# Altium schematic sheet MAIN.SchDoc: Shipwars Main Schematic
size 431 x 279 mm; Date: 02/14/2022; CheckedBy: SP, PS; Author: SP, PS; CompanyName: UPenn; DrawnBy: SP, PS; Engineer: SP, PS; Organization: UPenn; Address1: 200 S 33rd Street; Address2: Detkin Lab; Address3: Philadelphia; Address4: PA 19104; Revision: .1.0.0; SheetNumber: 1; SheetTotal: 10; Project: Shipwars; Time: 19:00
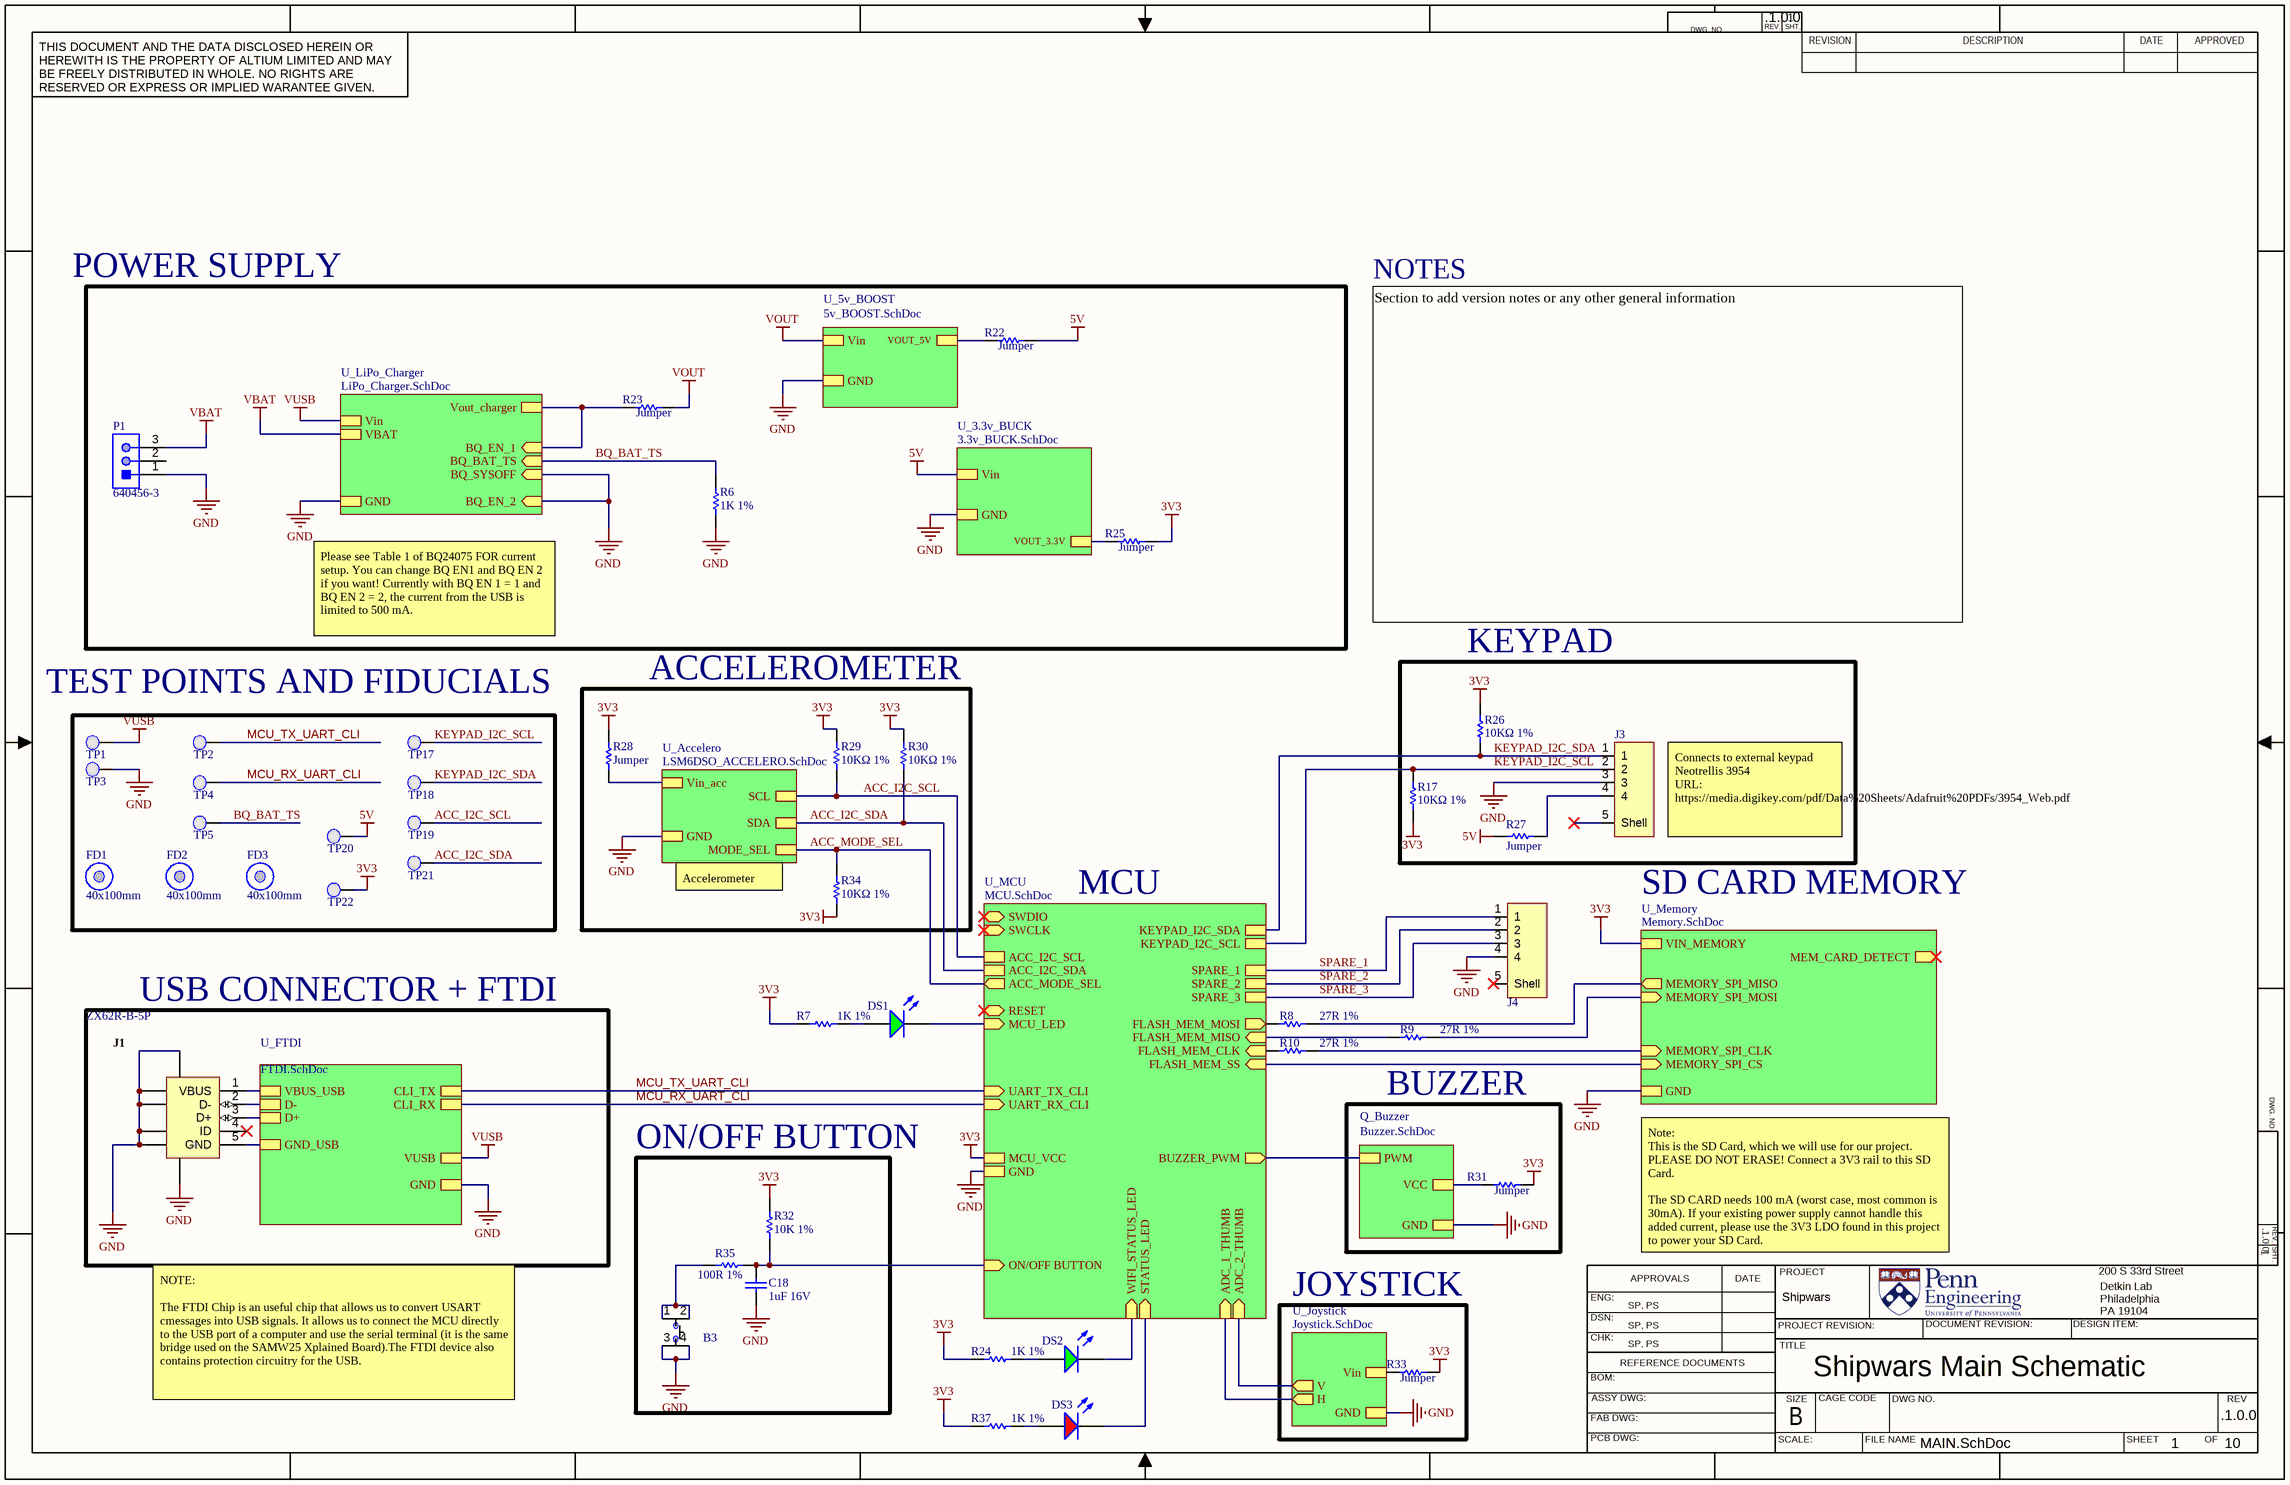
[diagram p0: MAIN.SchDoc]

## Parts
B3  PTS810 SJK 250 SMTR LFS  [PTS810 SJK 250 SMTR LFS]  (value not drawn)
C18  1uF 16V  [CAPC0603(1608)100_N]
DS1  LTST-C170GKT  [LTST-C170GKT_V]  (value not drawn)
DS2  LTST-C170GKT  [LTST-C170GKT_V]  (value not drawn)
DS3  LTST-C170CKT  [LTST-C170CKT_V]  (value not drawn)
FD1  40x100mm  [Fiducial_FT]  (no BOM)
FD2  40x100mm  [Fiducial_FT]  (no BOM)
FD3  40x100mm  [Fiducial_FT]  (no BOM)
J1  ZX62R-B-5P  [HIRO-ZX62R-B-5P_V]
J3  S4B-PH-SM4-TB(LF)(SN)  [S4B-PH-SM4-TB(LF)(SN)]  (value not drawn)
J4  S4B-PH-SM4-TB(LF)(SN)  [S4B-PH-SM4-TB(LF)(SN)]  (value not drawn)
P1  640456-3  [TECO-640456-3]
R6  1K 1%  [RESC0603(1608)_N]
R7  1K 1%  [RESC0603(1608)_N]
R8  27R 1%  [RESC0603(1608)_N]
R9  27R 1%  [RESC0603(1608)_N]
R10  27R 1%  [RESC0603(1608)_N]
R17  10KΩ 1%  [RESC0603(1608)_N]
R22  Jumper  [RESC0603(1608)_N]
R23  Jumper  [RESC0603(1608)_N]
R24  1K 1%  [RESC0603(1608)_N]
R25  Jumper  [RESC0603(1608)_N]
R26  10KΩ 1%  [RESC0603(1608)_N]
R27  Jumper  [RESC0603(1608)_N]
R28  Jumper  [RESC0603(1608)_N]
R29  10KΩ 1%  [RESC0603(1608)_N]
R30  10KΩ 1%  [RESC0603(1608)_N]
R31  Jumper  [RESC0603(1608)_N]
R32  10K 1%  [RESC0603(1608)_N]
R33  Jumper  [RESC0603(1608)_N]
R34  10KΩ 1%  [RESC0603(1608)_N]
R35  100R 1%  [RESC0603(1608)_N]
R37  1K 1%  [RESC0603(1608)_N]
TP1  0.1" Pad  [PCBComponent]  (value not drawn)  (no BOM)
TP2  0.1" Pad  [PCBComponent]  (value not drawn)  (no BOM)
TP3  0.1" Pad  [PCBComponent]  (value not drawn)  (no BOM)
TP4  0.1" Pad  [PCBComponent]  (value not drawn)  (no BOM)
TP5  0.1" Pad  [PCBComponent]  (value not drawn)  (no BOM)
TP17  0.1" Pad  [PCBComponent]  (value not drawn)  (no BOM)
TP18  0.1" Pad  [PCBComponent]  (value not drawn)  (no BOM)
TP19  0.1" Pad  [PCBComponent]  (value not drawn)  (no BOM)
TP20  0.1" Pad  [PCBComponent]  (value not drawn)  (no BOM)
TP21  0.1" Pad  [PCBComponent]  (value not drawn)  (no BOM)
TP22  0.1" Pad  [PCBComponent]  (value not drawn)  (no BOM)

## Blocks framed on the sheet
ACCELEROMETER: R28-R30 R34
KEYPAD: J3 R17 R26 R27
USB CONNECTOR + FTDI: J1
BUZZER: R31
ON/OFF BUTTON: B3 C18 R32 R35
JOYSTICK: R33

## Sub-sheets
Q_Buzzer = Buzzer.SchDoc: PWM, VCC, GND
U_3.3v_BUCK = 3.3v_BUCK.SchDoc: Vin, GND, VOUT_3.3V
U_5v_BOOST = 5v_BOOST.SchDoc: Vin, GND, VOUT_5V
U_Accelero = LSM6DSO_ACCELERO.SchDoc: Vin_acc, GND, SCL, SDA, MODE_SEL
U_FTDI = FTDI.SchDoc: VUSB, GND, VBUS_USB, D-, D+, GND_USB, CLI_RX, CLI_TX
U_Joystick = Joystick.SchDoc: GND, Vin, V (out), H (out)
U_LiPo_Charger = LiPo_Charger.SchDoc: BQ_EN_2 (in), BQ_SYSOFF (in), BQ_EN_1 (in), BQ_BAT_TS (in), Vin, GND, VBAT, Vout_charger
U_MCU = MCU.SchDoc: SWDIO (bidir), SWCLK (in), FLASH_MEM_SS (in), FLASH_MEM_CLK (in), FLASH_MEM_MISO (in), FLASH_MEM_MOSI (out), RESET (bidir), MCU_LED (in), MCU_VCC, KEYPAD_I2C_SCL, KEYPAD_I2C_SDA, UART_TX_CLI (in), UART_RX_CLI (in), GND, ON/OFF BUTTON (in), ADC_1_THUMB (in), ADC_2_THUMB (in), BUZZER_PWM (out), ACC_MODE_SEL (out), WIFI_STATUS_LED (in), STATUS_LED (in), SPARE_1, SPARE_2, SPARE_3, ACC_I2C_SCL, ACC_I2C_SDA
U_Memory = Memory.SchDoc: MEMORY_SPI_MOSI (in), MEMORY_SPI_MISO (out), MEMORY_SPI_CLK (in), MEMORY_SPI_CS (in), MEM_CARD_DETECT (out), VIN_MEMORY, GND

## Nets
3V3: R7.1 R17.2 R24.1 R25.2 R26.2 R28.2 R29.2 R30.2 R31.2 R32.2 R33.2 R34.1 R37.1 TP22.1(PAD) ; sheet U_MCU/MCU_VCC, sheet U_Memory/VIN_MEMORY
5V: R22.2 R27.2 TP20.1(PAD) ; sheet U_3.3v_BUCK/Vin
GND: B3.3 B3.4 C18.1 J1.6(SHLD) J1.7(SHLD) J1.8(SHLD) J1.9(SHLD) J1.10(SHLD) J1.11(SHLD) J3.3 J4.4 P1.1 R6.2 TP3.1(PAD) ; sheet U_FTDI/GND, sheet U_MCU/GND, sheet U_Memory/GND, sheet U_LiPo_Charger/BQ_EN_2, sheet U_LiPo_Charger/BQ_SYSOFF, sheet U_LiPo_Charger/GND, sheet U_5v_BOOST/GND, sheet U_3.3v_BUCK/GND, sheet U_Accelero/GND, sheet U_Joystick/GND, sheet Q_Buzzer/GND
VBAT: P1.3 ; sheet U_LiPo_Charger/VBAT
VOUT: R23.2 ; sheet U_5v_BOOST/Vin
VUSB: TP1.1(PAD) ; sheet U_FTDI/VUSB, sheet U_LiPo_Charger/Vin
ACC_I2C_SCL: R29.1 TP19.1(PAD) ; sheet U_MCU/ACC_I2C_SCL, sheet U_Accelero/SCL
ACC_I2C_SDA: R30.1 TP21.1(PAD) ; sheet U_MCU/ACC_I2C_SDA, sheet U_Accelero/SDA
ACC_MODE_SEL: R34.2 ; sheet U_MCU/ACC_MODE_SEL, sheet U_Accelero/MODE_SEL
BQ_BAT_TS: R6.1 TP5.1(PAD) ; sheet U_LiPo_Charger/BQ_BAT_TS
KEYPAD_I2C_SCL: J3.2 R17.1 TP17.1(PAD) ; sheet U_MCU/KEYPAD_I2C_SCL
KEYPAD_I2C_SDA: J3.1 R26.1 TP18.1(PAD) ; sheet U_MCU/KEYPAD_I2C_SDA
MCU_RX_UART_CLI: TP4.1(PAD) ; sheet U_FTDI/CLI_RX, sheet U_MCU/UART_RX_CLI
MCU_TX_UART_CLI: TP2.1(PAD) ; sheet U_FTDI/CLI_TX, sheet U_MCU/UART_TX_CLI
SPARE_1: J4.1 ; sheet U_MCU/SPARE_1
SPARE_2: J4.2 ; sheet U_MCU/SPARE_2
SPARE_3: J4.3 ; sheet U_MCU/SPARE_3
NetB3_1: B3.1 B3.2 R35.1
NetC18_2: C18.2 R32.1 R35.2 ; sheet U_MCU/ON/OFF BUTTON
NetDS1_1: DS1.1(A) R7.2
NetDS1_2: DS1.2(K) ; sheet U_MCU/MCU_LED
NetDS2_1: DS2.1(A) R24.2
NetDS2_2: DS2.2(K) ; sheet U_MCU/WIFI_STATUS_LED
NetDS3_1: DS3.1(A) R37.2
NetDS3_2: DS3.2(K) ; sheet U_MCU/STATUS_LED
NetJ1_1: J1.1(VBUS) ; sheet U_FTDI/VBUS_USB
NetJ1_2: J1.2(D-) ; sheet U_FTDI/D-
NetJ1_3: J1.3(D+) ; sheet U_FTDI/D+
NetJ1_5: J1.5(GND) ; sheet U_FTDI/GND_USB
NetJ3_4: J3.4 R27.1
NetR8_1: R8.1 ; sheet U_MCU/FLASH_MEM_MOSI
NetR8_2: R8.2 ; sheet U_Memory/MEMORY_SPI_MISO
NetR9_1: R9.1 ; sheet U_MCU/FLASH_MEM_MISO
NetR9_2: R9.2 ; sheet U_Memory/MEMORY_SPI_MOSI
NetR10_1: R10.1 ; sheet U_MCU/FLASH_MEM_CLK
NetR10_2: R10.2 ; sheet U_Memory/MEMORY_SPI_CLK
NetR22_1: R22.1 ; sheet U_5v_BOOST/VOUT_5V
NetR23_1: R23.1 ; sheet U_LiPo_Charger/BQ_EN_1, sheet U_LiPo_Charger/Vout_charger
NetR25_1: R25.1 ; sheet U_3.3v_BUCK/VOUT_3.3V
NetR28_1: R28.1 ; sheet U_Accelero/Vin_acc
NetR31_1: R31.1 ; sheet Q_Buzzer/VCC
NetR33_1: R33.1 ; sheet U_Joystick/Vin
(unnamed): sheet U_MCU/FLASH_MEM_SS, sheet U_Memory/MEMORY_SPI_CS
(unnamed): sheet U_MCU/ADC_1_THUMB, sheet U_Joystick/H
(unnamed): sheet U_MCU/ADC_2_THUMB, sheet U_Joystick/V
(unnamed): sheet U_MCU/BUZZER_PWM, sheet Q_Buzzer/PWM

Not connected (* = marked no-connect by the designer): J1 4(ID)*; J3 5(Shell)*; J4 5(Shell)*; P1 2

## Notes on the sheet
- POWER SUPPLY
- NOTES
- Please see Table 1 of BQ24075 FOR current setup. You can change BQ EN1 and BQ EN 2 if you want! Currently with BQ EN 1 = 1 and BQ EN 2 = 2, the current from the USB is limited to 500 mA.
- Section to add version notes or any other general information
- TEST POINTS AND FIDUCIALS
- Connects to external keypad Neotrellis 3954
  URL: https://media.digikey.com/pdf/Data%20Sheets/Adafruit%20PDFs/3954_Web.pdf
- Accelerometer
- MCU
- (near J3) SD CARD MEMORY
- Note:
  This is the SD Card, which we will use for our project. PLEASE DO NOT ERASE! Connect a 3V3 rail to this SD Card.
  The SD CARD needs 100 mA (worst case, most common is 30mA). If your existing power supply cannot handle this added current, please use the 3V3 LDO found in this project to power your SD Card.
- NOTE:
  The FTDI Chip is an useful chip that allows us to convert USART cmessages into USB signals. It allows us to connect the MCU directly to the USB port of a computer and use the serial terminal (it is the same bridge used on the SAMW25 Xplained Board).The FTDI device also contains protection circuitry for the USB.
- DWG. NO.
- REV.
- SHT.
- THIS DOCUMENT AND THE DATA DISCLOSED HEREIN OR HEREWITH IS THE PROPERTY OF ALTIUM LIMITED AND MAY BE FREELY DISTRIBUTED IN WHOLE. NO RIGHTS ARE RESERVED OR EXPRESS OR IMPLIED WARANTEE GIVEN.
- REVISION
- DESCRIPTION
- DATE
- APPROVED
- ENG:
- APPROVALS
- PROJECT
- DSN:
- CHK:
- REFERENCE DOCUMENTS
- PROJECT REVISION:
- TITLE
- DOCUMENT REVISION:
- DESIGN ITEM:
- BOM:
- FAB DWG:
- PCB DWG:
- ASSY DWG:
- SCALE:
- SIZE
- B
- CAGE CODE
- FILE NAME
- DWG NO.
- SHEET
- OF
- REV

## Library data of the parts
B3 = PTS810 SJK 250 SMTR LFS: SWITCH TACTILE SPST-NO 0.05A 16V Tactile Switch SPST-NO Top Actuated Surface Mount; Manufacturer: ITT /  C&K Components; Part # Aliases: Y97LT25B5DBFP; Operating Force: 2.6 N; Actuator: Oval; Current Rating: 50 mA; Voltage Rating DC: 16 VDC; Contact Form: SPST; Switch Function: OFF - (ON); Mounting Direction: Straight; Stem Height: 2.5 mm; Brand: C&K Components; Travel: 0.15 mm; Manufacturer Part Number: PTS810SJK250SMTRLFS; Product Category: Tactile Switches; RoHS: Details; Termination Style: J Form Lead; Mounting Style: SMD/SMT; Color: White; Packaging: Reel; Contact Plating: Silver; Operating Temperature Range: - 40 C to + 85 C; Series: PTS810; Factory Pack Quantity: 2900; ComponentLink1URL: https://datasheet.ciiva.com/18514/pts810-4mar13-18514061.pdf; ComponentLink1Description: https://datasheet.ciiva.com/18514/pts810-4mar13-18514061.pdf; ComponentLink2URL: https://datasheet.ciiva.com/18514/pts810-4mar13-18514062.pdf; ComponentLink2Description: https://datasheet.ciiva.com/18514/pts810-4mar13-18514062.pdf; ComponentLink3URL: https://datasheet.ciiva.com/18514/pts810-4mar13-18514063.pdf; ComponentLink3Description: https://datasheet.ciiva.com/18514/pts810-4mar13-18514063.pdf; Supplier 1: Digi-Key; Supplier Part Number 1: CKN10503CT-ND
C18 = CMP-1035-02736-1: CAP 1uF 16V ±5% 0603 (1608 Metric) Thickness 1mm SMD; Case-Metric: 1608; Case-EIA: 0603; Tolerance: Â±5%; Technology: SMT; Max Thickness: 1 mm; Rated Voltage: 16 V; Value: 1uF
DS1 DS2 = CMP-1674-00002-5: LED Uni-Color Green, 100 mW, 120 mA, -55 to 85 degC, 2-Pin SMD, RoHS, Tape and Reel; Manufacturer: Lite-On; PackageReference: C170GKT; ComponentLink1Description: Manufacturer URL; ComponentLink1URL: http://www.us.liteon.com/; Height: 1.1 mm; PackageDescription: 2-Pin Surface Mount Device, Body 2 x 1.25 mm; RoHSCompliant: true; Package Quantity: 1; Packaging: Tape and Reel; Mount: Surface Mount; Min Operating Temperature: -55 degC; DatasheetVersion: 03/2003; Max Operating Temperature: 85 degC; Pins: 2; Mounting Technology: Surface Mount; Length: 2 mm; Colour: Green; ComponentLink2URL: http://media.digikey.com/pdf/Data%20Sheets/Lite-On%20PDFs/LTST-C170GKT.pdf; ComponentLink2Description: Datasheet
DS3 = CMP-1674-00001-5: LED Uni-Color Red, 100 mW, 200 mA, -55 to 85 degC, 2-Pin SMD, RoHS, Tape and Reel; Manufacturer: Lite-On; PackageReference: C170CKT; ComponentLink1Description: Manufacturer URL; ComponentLink1URL: http://www.us.liteon.com/; Package Quantity: 3000; Packaging: Tape and Reel; Pins: 2; ComponentLink2URL: http://media.digikey.com/pdf/Data%20Sheets/Lite-On%20PDFs/LTST-C170CKT.pdf; Max Operating Temperature: 85 degC; Min Operating Temperature: -55 degC; Mounting Technology: Surface Mount; Mount: Surface Mount; Length: 2 mm; ComponentLink2Description: Datasheet; DatasheetVersion: 03/2003; Height: 1.1 mm; PackageDescription: 2-Pin Surface Mount Device, Body 2 x 1.25 mm; RoHSCompliant: true; Colour: Red
FD1-FD3 = CMP-00174-A.4: Fiducial 40x100mm
J1 = CMP-0031-00001-1: Connector; USBMicro-B,Reverse type, SMT; 5 Position; Right Angle; DatasheetVersion: 08/2010; Operating Temperature: -30 to 85 degC; Mounting Technology: Surface Mount; PartNumber: ZX62R-B-5P; PackageReference: ZX62R-B-5P; ComponentLink2URL: http://www.hirose.co.jp/cataloge_hp/e24200011.pdf; ComponentLink1URL: http://www.hirose.com/â€Ž; ComponentLink2Description: Datasheet; PackageDescription: 5-Pin USB Micro-B R/A Connector; ComponentLink1Description: Manufacturer URL
J3 J4 = S4B-PH-SM4-TB(LF)(SN): JST (JAPAN SOLDERLESS TERMINALS) - S4B-PH-SM4-TB(LF)(SN) - Wire-To-Board Connector, 2 mm, 4 Contacts, Header, PH Series, Surface Mount, 1 Rows; Number of Positions: 4; Insulation Resistance: 1GR; Gender: Male; Current Rating: 2A; Voltage Rating: 100V; Connector Type: Header,Male Pin; Contact Resistance: 20mR; Pitch: 2mm; Supplier 1: Newark; Manufacturer: JST; Manufacturer Part Number: S4B-PH-SM4-TB(LF)(SN); RoHS: Yes; Category: Connectors; Mount: Surface Mount; Housing Material: Polyamide; Color: Natural,White; Contact Material: Copper Alloy,Tin,Bronze,Brass; Contact Plating: Tin,Copper; Housing Color: Beige; Contact Shape: Square; Insulation Material: Nylon; Insulation Color: Natural; Min Operating Temperature: -25°C; Max Operating Temperature: 85°C; Termination: Solder; Number of Contacts: 4; Number of Rows: 1; Packaging: Tape and Reel; Voltage Rating (AC): 100V; Orientation: Right Angle; Fastening Type: Detent; Working Voltage: 100V; Max Voltage Rating (AC): 100V; Max Voltage Rating (DC): 100V; Number of Poles: 4; Max Current Rating: 2A; Length: 11.9mm; Width: 5mm; Height: 9.4mm; Contact Mating Length: 0.13inch; Depth: 7.6mm; Lead Pitch: 2mm; Lead Free: Lead Free; REACH SVHC: No SVHC; Flammability Rating: UL94 V-0; ComponentLink1URL: https://datasheet.ciiva.com/11746/0900766b80df0d9d-11746552.pdf?src-supplier=RSComponents; ComponentLink1Description: https://datasheet.ciiva.com/11746/0900766b80df0d9d-11746552.pdf?src-supplier=RSComponents; ComponentLink2URL: https://datasheet.ciiva.com/712/eph-712578.pdf?src-supplier=Digi-Key; ComponentLink2Description: https://datasheet.ciiva.com/712/eph-712578.pdf?src-supplier=Digi-Key; ComponentLink3URL: https://datasheet.ciiva.com/712/eph-712579.pdf?src-supplier=Digi-Key; ComponentLink3Description: https://datasheet.ciiva.com/712/eph-712579.pdf?src-supplier=Digi-Key; ComponentLink4URL: https://datasheet.ciiva.com/730/eph-730675.pdf?src-supplier=Digi-Key; ComponentLink4Description: https://datasheet.ciiva.com/730/eph-730675.pdf?src-supplier=Digi-Key; ComponentLink5URL: https://datasheet.ciiva.com/8052/1699381-8052234.pdf?src-supplier=Element14; ComponentLink5Description: https://datasheet.ciiva.com/8052/1699381-8052234.pdf?src-supplier=Element14; ComponentLink6URL: https://datasheet.ciiva.com/26894/getdatasheetpartid-639990-26894620.pdf?src-supplier=Verical; ComponentLink6Description: https://datasheet.ciiva.com/26894/getdatasheetpartid-639990-26894620.pdf?src-supplier=Verical; ComponentLink7URL: https://datasheet.ciiva.com/16376/eph-16376783.pdf?src-supplier=Future+Electronics; ComponentLink7Description: https://datasheet.ciiva.com/16376/eph-16376783.pdf?src-supplier=Future+Electronics; Supplier Part Number 1: 38K8075
P1 = CMP-2000-05418-1: Male Header, Pitch 2.54 mm, 1 x 3 Position, Height 10.03 mm, Tail Length 3.56 mm, -55 to 105 degC; Manufacturer: TE Connectivity; Agency Approvals: CSA,UL; Angle: Straight; Number of Positions: 3; Standards: RoHSCompliant,ELVCompliant,UL94V-0; Current, Rating: 5 / A; Connector Type: MTA-100; Mount Angle: Vertical; Material, Housing: Polyester; Temperature, Operating: -55to+105 / degC; Voltage, Rating: 250 / V; Color, Housing: White; Contact Centerline Spacing: 0.100 / in.; Special Features: Pinstrip; Material, Contact: CopperAlloy; Contact Termination Area Plating: Tin; Primary Type: InterconnectSystem; Pin Spacing: 0.1 / "; Brand/Series: MTA-100Series; Mounting Hole Size: 0.04 / "; Manufacturer URL: http://www.te.com/; Datasheet URL: https://datasheet.ciiva.com/16456/eng-ds-82056-mta-0608-16456886.pdf; Flammability Rating: UL94V-0; Mounting Type: PCMount; Contact Mating Area Plating: Tin; Datasheet Version: Jun-08; Number of Rows: 1; Termination: Solder; Type: PCBPlug; Length, Pin: 0.14 / "; Color: White; Contact Plating: Tin; Contact Shape: Square; Number of Contacts: 3; Size, Post: 0.025 / in.; Length, Terminal Post: 0.14 / in.; Length, Overall: 0.3 / "
R6 R7 R24 R37 = CMP-1012-00510-1: 1K 0.1W 1% 0603 (1608 Metric)  SMD; Case-Metric: 1608; Case-EIA: 0603; Value: 1000.00 Ohm; Technology: SMT; Tolerance: 1 %; Power: 0.1 W
R8-R10 = CMP-1012-00331-1: 27R 0.1W 1% 0603 (1608 Metric)  SMD; Case-EIA: 0603; Value: 27.00 Ohm; Case-Metric: 1608; Technology: SMT; Tolerance: 1 %; Power: 0.1 W
R17 R26 R29 R30 R32 R34 = CMP-1012-00623-1: 10K 0.1W 1% 0603 (1608 Metric)  SMD; Value: 10000.00 Ohm; Case-EIA: 0603; Case-Metric: 1608; Power: 0.1 W; Tolerance: 1 %; Technology: SMT
R22 R23 R25 R27 R28 R31 R33 = CMP-1012-00001-1: Jumper 0603 (1608 Metric); Case-Metric: 1608; Value: 0.00 Ohm; Power: None; Case-EIA: 0603; Technology: SMT; Tolerance: None
R35 = CMP-1012-00397-1: 100R 0.1W 1% 0603 (1608 Metric)  SMD; Value: 100.00 Ohm; Case-EIA: 0603; Case-Metric: 1608; Technology: SMT; Tolerance: 1 %; Power: 0.1 W
TP1-TP5 TP17-TP22 = 0.1" Pad-A.4